# EAGLE design front_board (EAGLE 9.6.2)
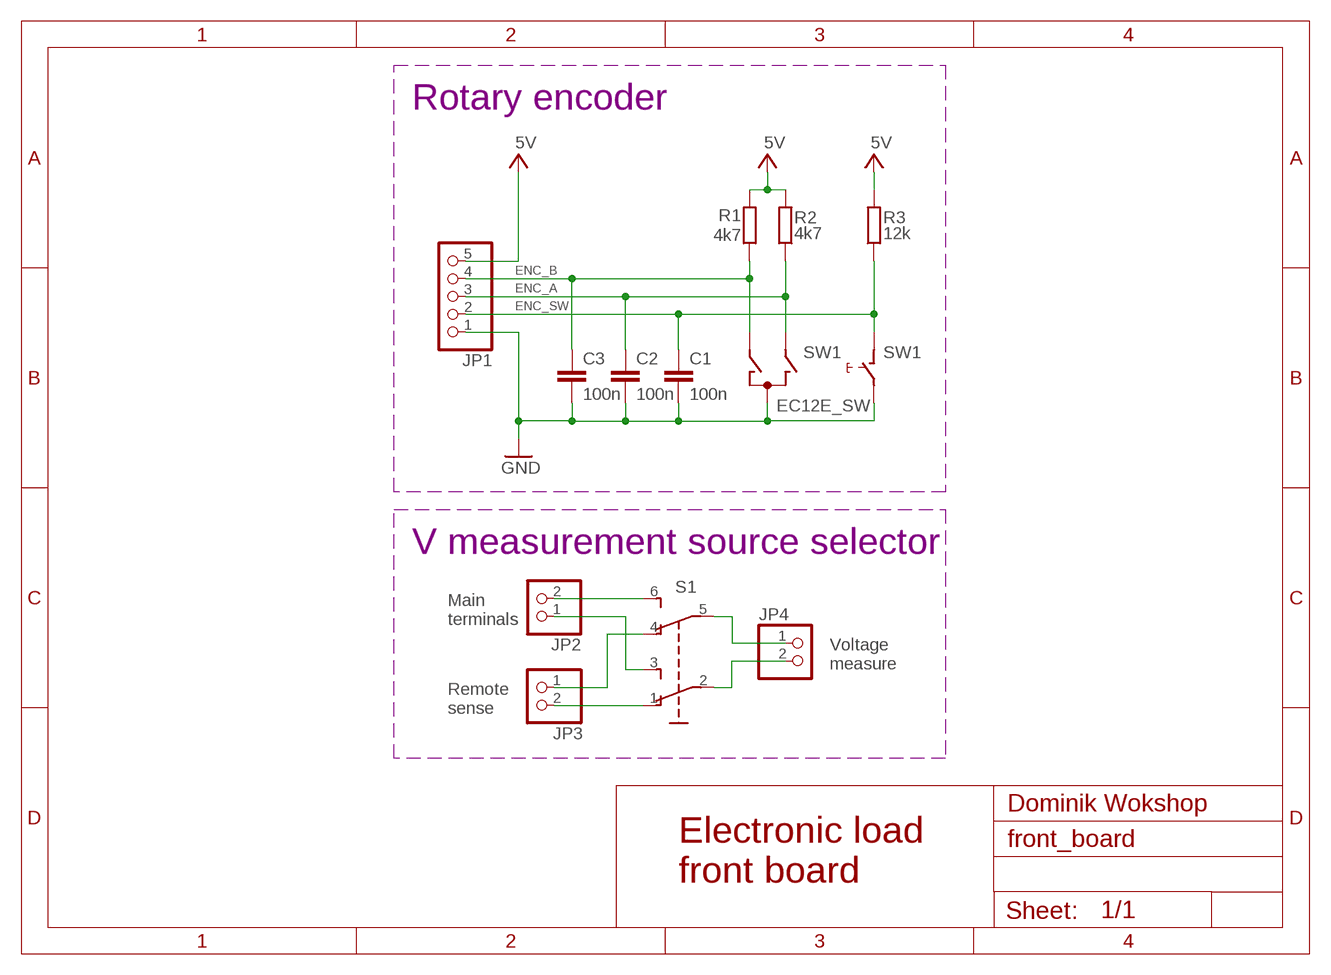
[diagram p0: schematic, sheet 1]

## Parts
C1  100n  C-EUC0603  [C0603]
C2  100n  C-EUC0603  [C0603]
C3  100n  C-EUC0603  [C0603]
JP1  PINHD-1X5/90  [1X05/90]
JP2  PINHD-1X2/90  [1X02/90]
JP3  PINHD-1X2/90  [1X02/90]
JP4  PINHD-1X2/90  [1X02/90]
R1  4k7  R-EU_R0603  [R0603]
R2  4k7  R-EU_R0603  [R0603]
R3  12k  R-EU_R0603  [R0603]
S1  TL46PO  [TL4XPO]
SW1  EC12E_SW  [ALPS_EC12E_SW]

## Nets
5V: JP1.5 R1.2 R2.2 R3.2 ; supply symbol labelled VCC
ENC_A: C2.1 JP1.3 R2.1 SW1.B
ENC_B: C3.1 JP1.4 R1.1 SW1.A
ENC_SW: C1.1 JP1.2 R3.1 SW1.D
GND: C1.2 C2.2 C3.2 JP1.1 SW1.C SW1.E
N$1: JP4.2 S1.2(P)
N$2: JP3.2 S1.1(O)
N$5: JP4.1 S1.5(P1)
N$7: JP3.1 S1.4(O1)
N$8: JP2.1 S1.3(S)
N$9: JP2.2 S1.6(S1)
Unconnected: SW1.GND1(G) SW1.GND2(G)

## Notes on the sheet
- Rotary encoder
- V measurement source selector
- Main
  terminals
- Voltage
  measure
- Remote
  sense
- Dominik Wokshop
- Electronic load
  front board

## Library data of the parts
C1-C3 = rcl:C-EU: CAPACITOR, European symbol; SPICEPREFIX: C
JP1 = pinhead:PINHD-1X5: PIN HEADER
JP2-JP4 = pinhead:PINHD-1X2: PIN HEADER
R1-R3 = rcl:R-EU_: RESISTOR, European symbol; SPICEPREFIX: R
S1 = switch:TL46PO: TINY SWITCH ON - ON Source: http://www2.produktinfo.conrad.com/datenblaetter/700000-724999/705152-da-01-de-Subminiaturschalter_TL_36YO.pdf
SW1 = switch-alps:EC12E_SW: ALPS rotary Encoder EC12E series with switch; MPN: EC12E2424407; OC_FARNELL: 1520813; OC_NEWARK: 74M1068

## Board
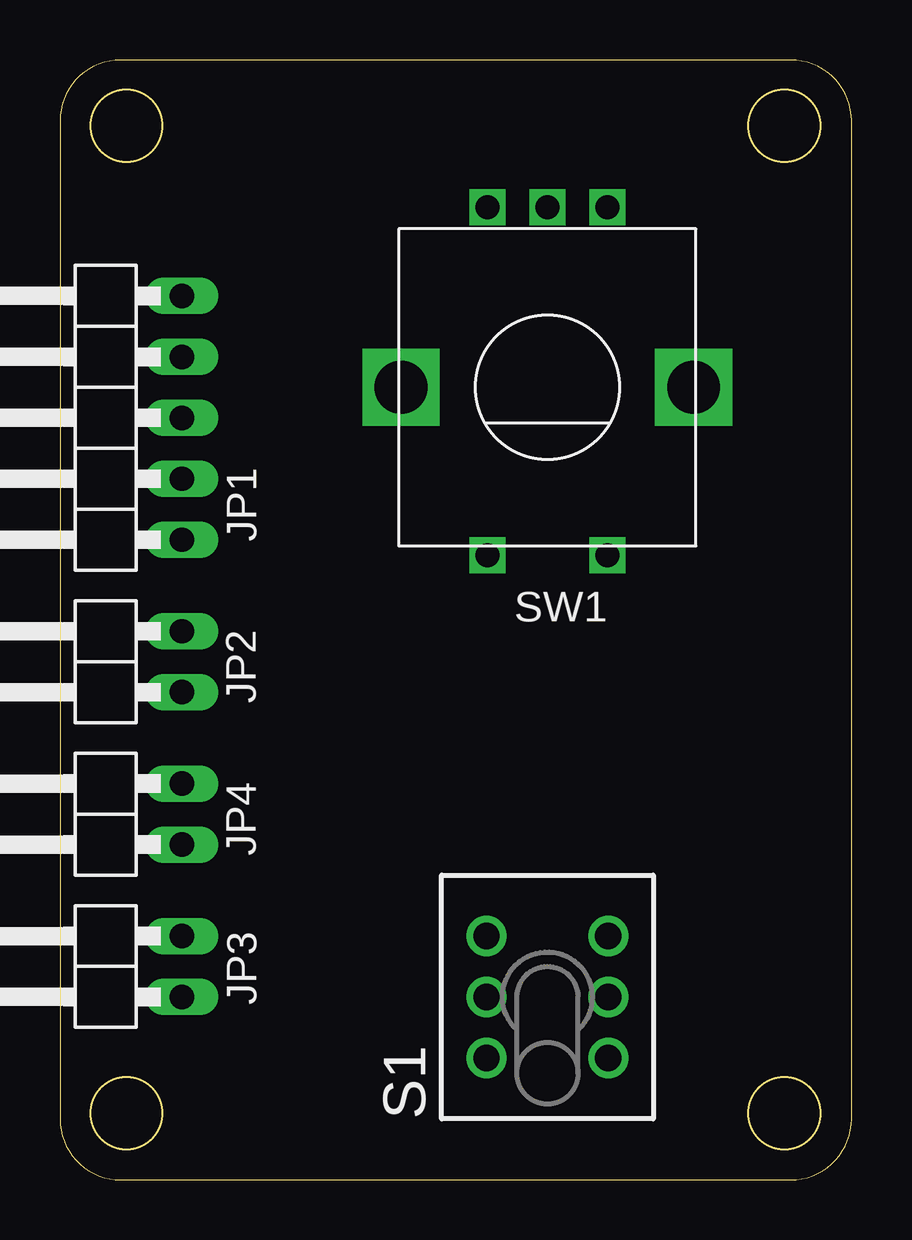
[diagram p1: board, top side]
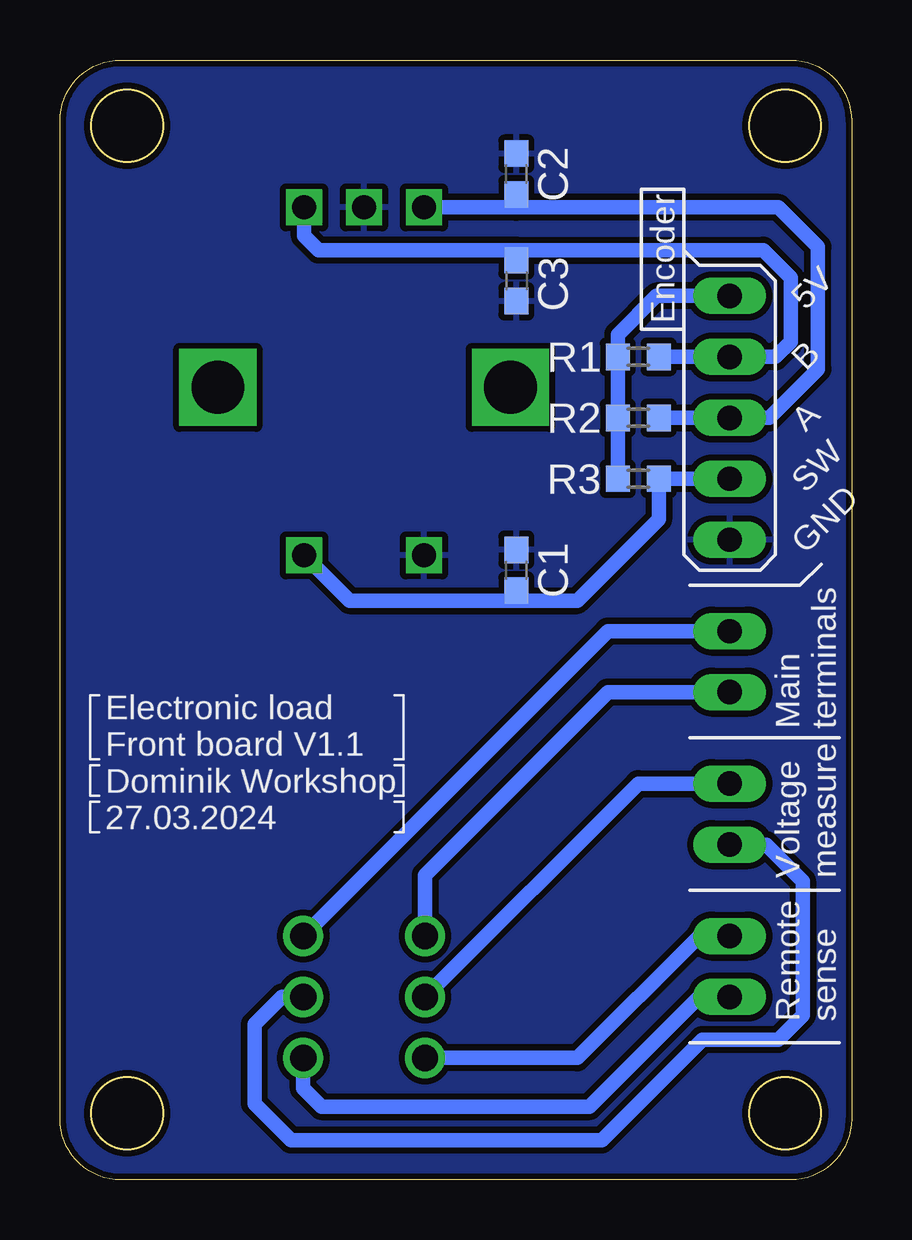
[diagram p2: board, bottom side, seen from below]

Size 33 x 46.66 mm. Coordinates in mm from the lower left corner, seen from the top.
Outline: 0,44.12 0,2.54 arc90 2.54,0 30.46,0 arc90 33,2.54 33,44.12 arc90 30.46,46.66 2.54,46.66 arc90 0,44.12
Outline: circle at 2.77,2.77 radius 1.5
Outline: circle at 30.2,2.77 radius 1.5
Outline: circle at 2.77,43.92 radius 1.5
Outline: circle at 30.2,43.92 radius 1.5
Copper layers (1*16): Top 0.035mm / dielectric 1.5mm / Bottom 0.035mm
Design rules "default *": minimum track width 6mil, minimum drill 0.35mm, track to track 6mil, track to pad 6mil, pad to pad 6mil, via to via 6mil, smd to smd 6mil, copper to edge 1mil, drill to drill 6mil, minimum pad ring 10mil, minimum via ring 8mil, stop-mask expansion 4mil, vias tented up to drill 0mil, thermal gap 10mil

### Footprints (pad centres in the part's own frame; a part is rotated, then mirrored left to right if it is on the bottom)
C0603 = smd 1.1 x 1: 1 -0.85,0; 2 0.85,0
1X05/90 = drill 1.016 long: 1 -5.08,-3.81; 2 -2.54,-3.81; 3 0,-3.81; 4 2.54,-3.81; 5 5.08,-3.81
1X02/90 = drill 1.016 long: 1 -1.27,-3.81; 2 1.27,-3.81
R0603 = smd 1 x 1.1: 1 -0.85,0; 2 0.85,0
TL4XPO = drill 1.1 pad 1.676: 1 -2.54,2.54; 2 0,2.54; 3 2.54,2.54; 4 -2.54,-2.54; 5 0,-2.54; 6 2.54,-2.54
ALPS_EC12E_SW = drill 1 square: A -2.5,-7.5; B 2.5,-7.5; C 0,-7.5; D -2.5,7; E 2.5,7 | drill 2.2 square: GND1 -6.1,0; GND2 6.1,0

### Placement (x,y rotation side)
C1  13.97,25.4 90 bottom
C2  13.97,41.91 90 bottom
C3  13.97,37.47 270 bottom
JP1  1.27,31.75 90 top
JP2  1.27,21.59 90 top
JP3  1.27,8.89 90 top
JP4  1.27,15.24 90 top
R1  8.89,34.29 180 bottom
R2  8.89,31.75 180 bottom
R3  8.89,29.21 180 bottom
S1  20.32,7.62 90 top
SW1  20.32,33.02 180 top

### Tracks (layer width: path | path; a pad name or v marks a point on that pad's centre or on a via)
5V
  Bottom 0.61: R3.2 R2.2 R1.2 9.74,35.22 8.13,36.83 JP1.5
ENC_A
  Bottom 0.61: R2.1 JP1.3 3.43,31.75 1.4,33.78 1.4,38.87 3.05,40.52 13.97,40.52 | 13.97,40.52 SW1.B | C2.1 13.97,40.52
ENC_B
  Bottom 0.61: R1.1 JP1.4 3.17,34.29 2.54,34.92 2.54,37.59 3.68,38.73 13.97,38.73 | SW1.A 22.82,39.33 22.23,38.73 13.97,38.73 | C3.1 13.97,38.73
ENC_SW
  Bottom 0.61: JP1.2 R3.1 8.04,27.52 11.43,24.13 13.97,24.13 | SW1.D 20.93,24.13 13.97,24.13 | C1.1 13.97,24.13
GND
  pour Bottom (isolate 0.254): 0,46.74 33.02,46.74 33.02,0 0,0
N$1
  Bottom 0.61: S1.2 8.89,16.51 JP4.2
N$2
  Bottom 0.61: JP3.2 6.35,10.16 11.43,5.08 S1.1
N$5
  Bottom 0.61: JP4.1 3.56,13.97 2.03,12.45 2.03,6.86 3.05,5.84 6.22,5.84 10.41,1.65 23.37,1.65 24.89,3.17 24.89,6.48 23.75,7.62 S1.5
N$7
  Bottom 0.61: S1.4 22.86,3.81 22.1,3.05 10.92,3.05 6.35,7.62 JP3.1
N$8
  Bottom 0.61: JP2.1 10.16,20.32 17.78,12.7 S1.3
N$9
  Bottom 0.61: JP2.2 10.16,22.86 S1.6

### Text on the board
bNames: 5V | Encoder | B | A | SW | GND | Main / terminals | Electronic load / Front board V1.1 / Dominik Workshop / 27.03.2024 | Voltage / measure | Remote / sense